# Altium schematic sheet STM32H730_PINOUT.SchDoc
size D; SheetNumber: 17; SheetTotal: 19
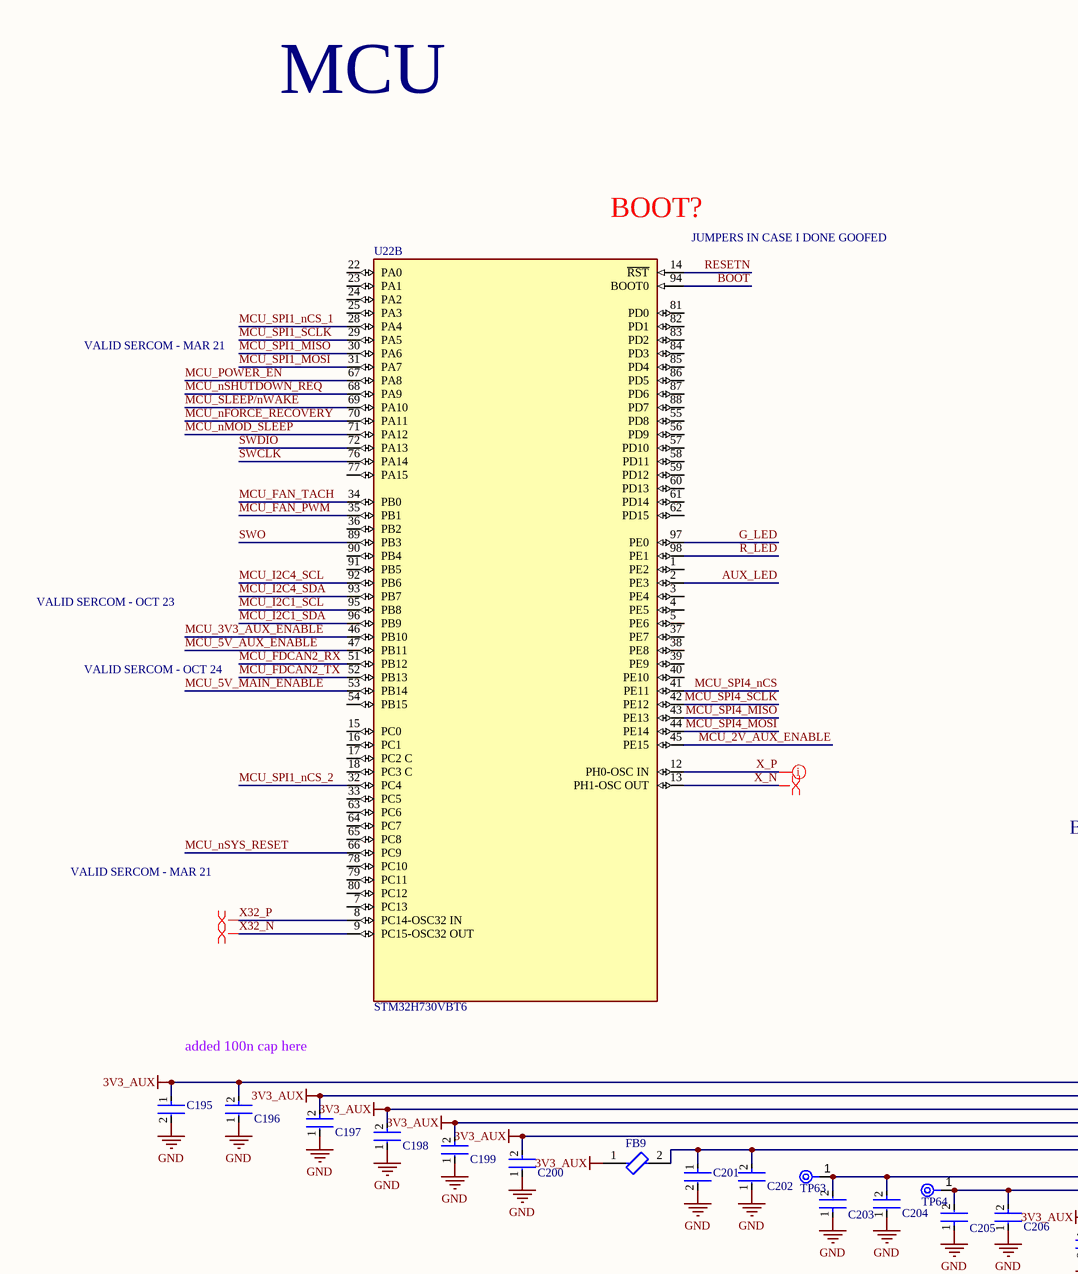
[diagram p0: STM32H730_PINOUT.SchDoc, top left]
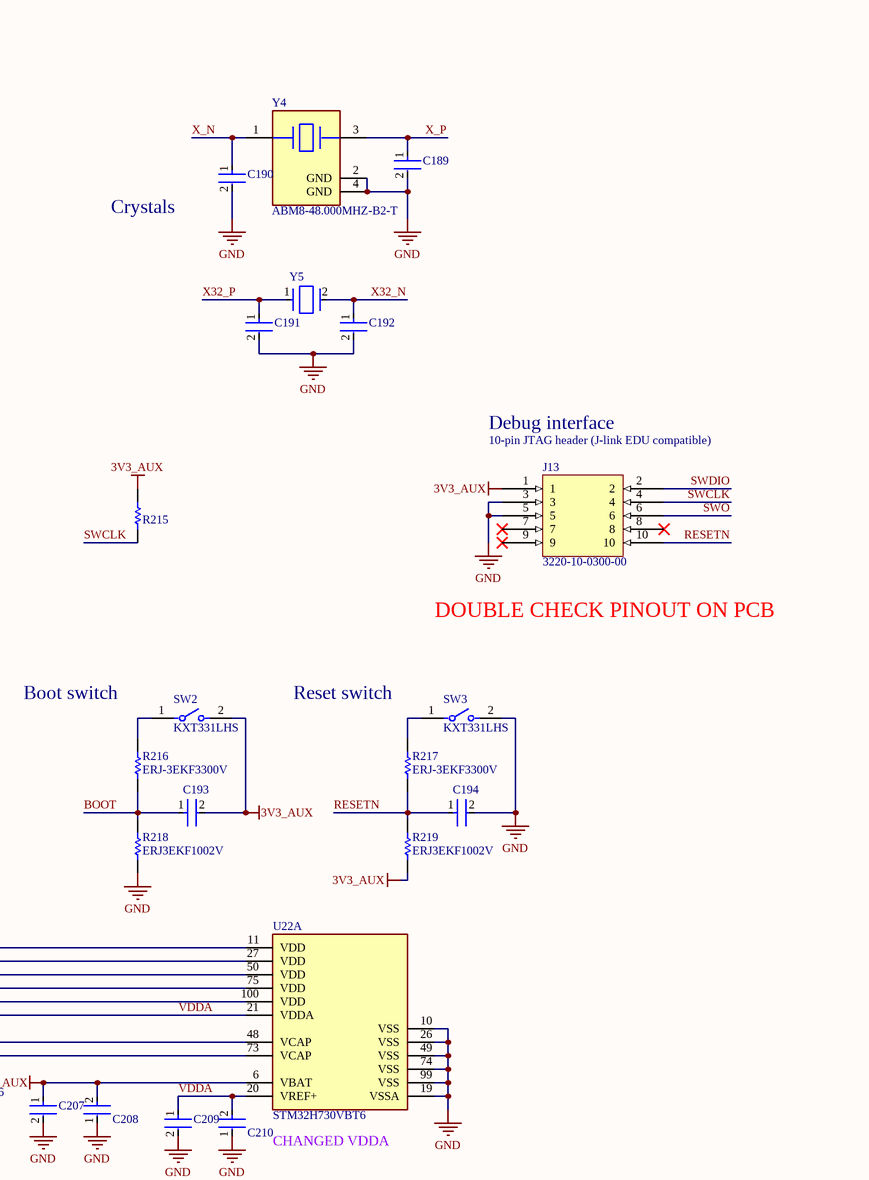
[diagram p1: STM32H730_PINOUT.SchDoc, top middle]
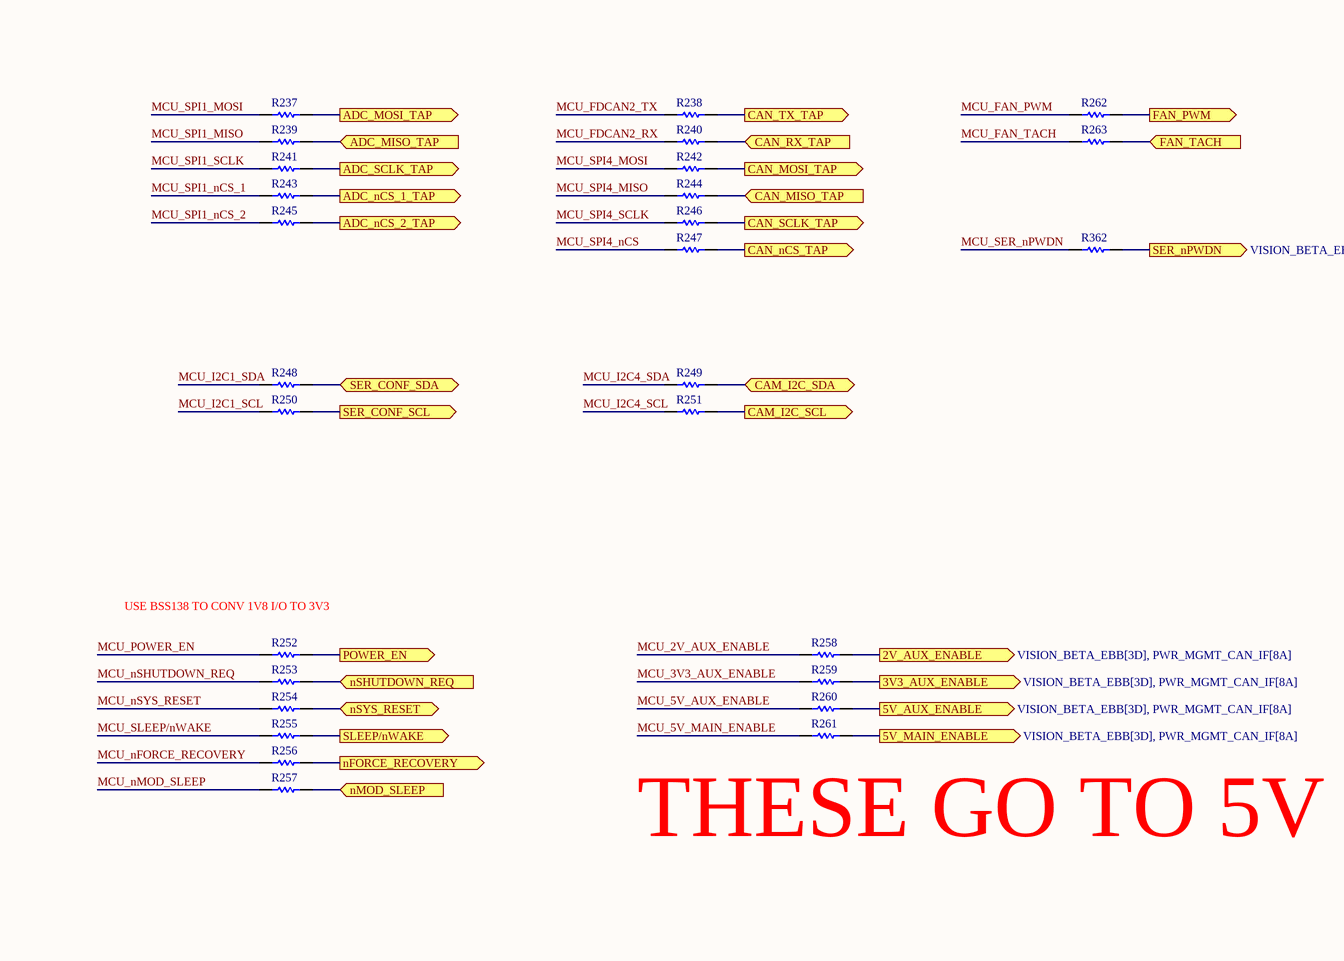
[diagram p2: STM32H730_PINOUT.SchDoc, top right]
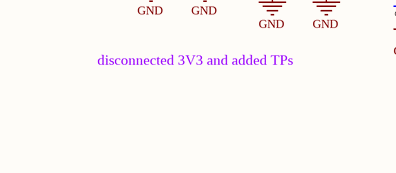
[diagram p3: STM32H730_PINOUT.SchDoc, bottom left]
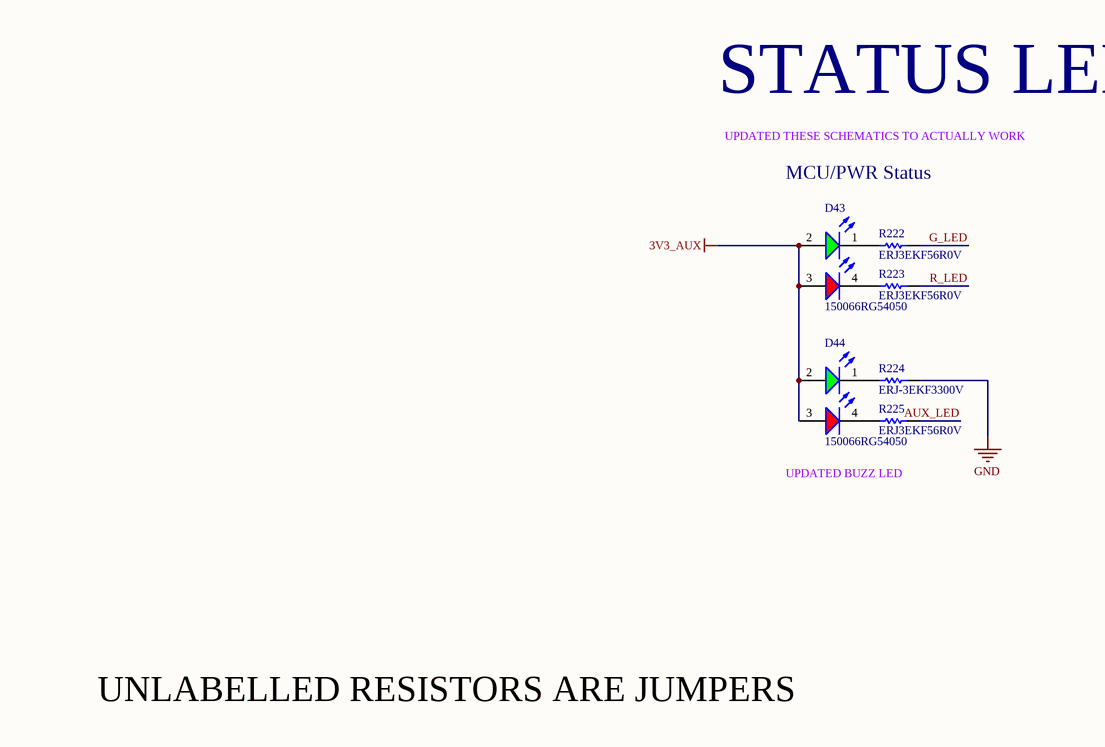
[diagram p4: STM32H730_PINOUT.SchDoc, bottom right]

## Parts
C189  C0402C689C5GACTU  [FP-C0402-BB-MFG]  (value not drawn)
C190  C0402C689C5GACTU  [FP-C0402-BB-MFG]  (value not drawn)
C191  04025A180FAT2A  [FP-0402-L_1_0_1-W_0_5_0_1-IPC_A]  (value not drawn)
C192  04025A180FAT2A  [FP-0402-L_1_0_1-W_0_5_0_1-IPC_A]  (value not drawn)
C193  C0402C104K8PACTU  [FP-C0402-BB-MFG]  (value not drawn)
C194  C0402C104K8PACTU  [FP-C0402-BB-MFG]  (value not drawn)
C195  C1005X5R1A475K050BC  [FP-C1005-050-0_15-MFG]  (value not drawn)
C196  GRM155R71C104KA88D  [FP-GRM15-MFG]  (value not drawn)
C197  GRM155R71C104KA88D  [FP-GRM15-MFG]  (value not drawn)
C198  GRM155R71C104KA88D  [FP-GRM15-MFG]  (value not drawn)
C199  GRM155R71C104KA88D  [FP-GRM15-MFG]  (value not drawn)
C200  GRM155R71C104KA88D  [FP-GRM15-MFG]  (value not drawn)
C201  EMK105BJ105KV-F  [FP-0402-L_1_0_0_05-W_0_5-IPC_A]  (value not drawn)
C202  GRM155R71C104KA88D  [FP-GRM15-MFG]  (value not drawn)
C203  C1005X7S1A225K050BC  [FP-C1005-050-0_15-0_1-MFG]  (value not drawn)
C204  GRM155R71C104KA88D  [FP-GRM15-MFG]  (value not drawn)
C205  C1005X7S1A225K050BC  [FP-C1005-050-0_15-0_1-MFG]  (value not drawn)
C206  GRM155R71C104KA88D  [FP-GRM15-MFG]  (value not drawn)
C207  EMK105BJ105KV-F  [FP-0402-L_1_0_0_05-W_0_5-IPC_A]  (value not drawn)
C208  GRM155R71C104KA88D  [FP-GRM15-MFG]  (value not drawn)
C209  EMK105BJ105KV-F  [FP-0402-L_1_0_0_05-W_0_5-IPC_A]  (value not drawn)
C210  GRM155R71C104KA88D  [FP-GRM15-MFG]  (value not drawn)
D43  150066RG54050  [WL-SBCD_0606]
D44  150066RG54050  [WL-SBCD_0606]
FB9  BLM15PX601SN1D  [FP-BLM15-0_05-MFG]  (value not drawn)
J13  3220-10-0300-00  [3220-10-0300-00-Footprint-1]
R215  ERJ3EKF1002V  [RESC1609X55X30LL15T15]  (value not drawn)
R216  ERJ-3EKF3300V  [RESC1608X55X30LL15T15]
R217  ERJ-3EKF3300V  [RESC1608X55X30LL15T15]
R218  ERJ3EKF1002V  [RESC1609X55X30LL15T15]
R219  ERJ3EKF1002V  [RESC1609X55X30LL15T15]
R222  ERJ3EKF56R0V  [RESC1608X55X30NL15T15]
R223  ERJ3EKF56R0V  [RESC1608X55X30NL15T15]
R224  ERJ-3EKF3300V  [RESC1608X55X30LL15T15]
R225  ERJ3EKF56R0V  [RESC1608X55X30NL15T15]
R237  0402 JUMPER  [RESC1005X40X25ML05T05]  (value not drawn)
R238  0402 JUMPER  [RESC1005X40X25ML05T05]  (value not drawn)
R239  0402 JUMPER  [RESC1005X40X25ML05T05]  (value not drawn)
R240  0402 JUMPER  [RESC1005X40X25ML05T05]  (value not drawn)
R241  0402 JUMPER  [RESC1005X40X25ML05T05]  (value not drawn)
R242  0402 JUMPER  [RESC1005X40X25ML05T05]  (value not drawn)
R243  0402 JUMPER  [RESC1005X40X25ML05T05]  (value not drawn)
R244  0402 JUMPER  [RESC1005X40X25ML05T05]  (value not drawn)
R245  0402 JUMPER  [RESC1005X40X25ML05T05]  (value not drawn)
R246  0402 JUMPER  [RESC1005X40X25ML05T05]  (value not drawn)
R247  0402 JUMPER  [RESC1005X40X25ML05T05]  (value not drawn)
R248  0402 JUMPER  [RESC1005X40X25ML05T05]  (value not drawn)
R249  0402 JUMPER  [RESC1005X40X25ML05T05]  (value not drawn)
R250  0402 JUMPER  [RESC1005X40X25ML05T05]  (value not drawn)
R251  0402 JUMPER  [RESC1005X40X25ML05T05]  (value not drawn)
R252  0402 JUMPER  [RESC1005X40X25ML05T05]  (value not drawn)
R253  0402 JUMPER  [RESC1005X40X25ML05T05]  (value not drawn)
R254  0402 JUMPER  [RESC1005X40X25ML05T05]  (value not drawn)
R255  0402 JUMPER  [RESC1005X40X25ML05T05]  (value not drawn)
R256  0402 JUMPER  [RESC1005X40X25ML05T05]  (value not drawn)
R257  0402 JUMPER  [RESC1005X40X25ML05T05]  (value not drawn)
R258  0402 JUMPER  [RESC1005X40X25ML05T05]  (value not drawn)
R259  0402 JUMPER  [RESC1005X40X25ML05T05]  (value not drawn)
R260  0402 JUMPER  [RESC1005X40X25ML05T05]  (value not drawn)
R261  0402 JUMPER  [RESC1005X40X25ML05T05]  (value not drawn)
R262  0402 JUMPER  [RESC1005X40X25ML05T05]  (value not drawn)
R263  0402 JUMPER  [RESC1005X40X25ML05T05]  (value not drawn)
R362  0402 JUMPER  [RESC1005X40X25ML05T05]  (value not drawn)
SW2  KXT331LHS  [FP-KXT331LHS-MFG]
SW3  KXT331LHS  [FP-KXT331LHS-MFG]
TP63  TPAD6R  [New footprint 1]  (value not drawn)
TP64  TPAD6R  [New footprint 1]  (value not drawn)
U22  STM32H730VBT6  [FP-LQFP100-1L-IPC_C]  (parts A,B of 2)
Y4  ABM8-48.000MHZ-B2-T  [FP-ABM8-MFG]
Y5  ECS-.327-12.5-1210-TR  [FP-ECX-1210-MFG]  (value not drawn)

## Ports
2V_AUX_ENABLE (out, see VISION_BETA_EBB[3D], PWR_MGMT_CAN_IF[8A]), 3V3_AUX_ENABLE (out, see VISION_BETA_EBB[3D], PWR_MGMT_CAN_IF[8A]), 5V_AUX_ENABLE (out, see VISION_BETA_EBB[3D], PWR_MGMT_CAN_IF[8A]), 5V_MAIN_ENABLE (out, see VISION_BETA_EBB[3D], PWR_MGMT_CAN_IF[8A]), ADC_MISO_TAP (in, see VISION_BETA_EBB[3D]), ADC_MOSI_TAP (out, see VISION_BETA_EBB[3D]), ADC_nCS_1_TAP (out, see VISION_BETA_EBB[3D]), ADC_nCS_2_TAP (out, see VISION_BETA_EBB[3D]), ADC_SCLK_TAP (out, see VISION_BETA_EBB[3D]), CAM_I2C_SCL (out, see VISION_BETA_EBB[3D]), CAM_I2C_SDA (bidir, see VISION_BETA_EBB[3D]), CAN_MISO_TAP (in, see VISION_BETA_EBB[3D], PWR_MGMT_CAN_IF[1C]), CAN_MOSI_TAP (out, see VISION_BETA_EBB[3D], PWR_MGMT_CAN_IF[1C]), CAN_nCS_TAP (out, see VISION_BETA_EBB[3D], PWR_MGMT_CAN_IF[1C]), CAN_RX_TAP (in, see VISION_BETA_EBB[3D]), CAN_SCLK_TAP (out, see VISION_BETA_EBB[3D], PWR_MGMT_CAN_IF[1C]), CAN_TX_TAP (out, see VISION_BETA_EBB[3D]), FAN_PWM (out, see VISION_BETA_EBB[3D], FAN_IF[1A]), FAN_TACH (in, see VISION_BETA_EBB[3D], FAN_IF[1A]), nFORCE_RECOVERY (out, see VISION_BETA_EBB[3D], JETSON[9D], PWR_MGMT_CAN_IF[3A]), nMOD_SLEEP (in, see VISION_BETA_EBB[3D], JETSON[9D], PWR_MGMT_CAN_IF[3A]), nSHUTDOWN_REQ (in, see VISION_BETA_EBB[3D], JETSON[9C], PWR_MGMT_CAN_IF[3A]), nSYS_RESET (bidir, see VISION_BETA_EBB[3D], JETSON[9D], PWR_MGMT_CAN_IF[3A]), POWER_EN (out, see VISION_BETA_EBB[3D], JETSON[9D], PWR_MGMT_CAN_IF[3A]), SER_CONF_SCL (out, see VISION_BETA_EBB[3D]), SER_CONF_SDA (bidir, see VISION_BETA_EBB[3D]), SER_nPWDN (out, see VISION_BETA_EBB[3D]), SLEEP/nWAKE (out, see VISION_BETA_EBB[3D], JETSON[9C], PWR_MGMT_CAN_IF[3A])

## Nets
3V3_AUX: C193.2 C195.1 C196.2 C197.2 C198.2 C199.2 C200.2 C207.1 C208.2 D43.2(A) D43.3(A) D44.2(A) D44.3(A) FB9.1 J13.1 R215.1 R219.1 SW2.2 U22.6(VBAT) U22.11(VDD) U22.27(VDD) U22.50(VDD) U22.75(VDD) U22.100(VDD)
GND: C189.2 C190.2 C191.2 C192.2 C194.2 C195.2 C196.1 C197.1 C198.1 C199.1 C200.1 C201.2 C202.1 C203.1 C204.1 C205.1 C206.1 C207.2 C208.1 C209.2 C210.1 J13.3 J13.5 R218.1 R224.2 SW3.2 U22.10(VSS) U22.19(VSSA) U22.26(VSS) U22.49(VSS) U22.74(VSS) U22.99(VSS) Y4.2(GND) Y4.4(GND)
2V_AUX_ENABLE: R258.2 ; port 2V_AUX_ENABLE
3V3_AUX_ENABLE: R259.2 ; port 3V3_AUX_ENABLE
5V_AUX_ENABLE: R260.2 ; port 5V_AUX_ENABLE
5V_MAIN_ENABLE: R261.2 ; port 5V_MAIN_ENABLE
ADC_MISO_TAP: R239.2 ; port ADC_MISO_TAP
ADC_MOSI_TAP: R237.2 ; port ADC_MOSI_TAP
ADC_nCS_1_TAP: R243.2 ; port ADC_nCS_1_TAP
ADC_nCS_2_TAP: R245.2 ; port ADC_nCS_2_TAP
ADC_SCLK_TAP: R241.2 ; port ADC_SCLK_TAP
AUX_LED: R225.1 U22.2(PE3)
BOOT: C193.1 R216.1 R218.2 U22.94(BOOT0)
CAM_I2C_SCL: R251.2 ; port CAM_I2C_SCL
CAM_I2C_SDA: R249.2 ; port CAM_I2C_SDA
CAN_MISO_TAP: R244.2 ; port CAN_MISO_TAP
CAN_MOSI_TAP: R242.2 ; port CAN_MOSI_TAP
CAN_nCS_TAP: R247.2 ; port CAN_nCS_TAP
CAN_RX_TAP: R240.2 ; port CAN_RX_TAP
CAN_SCLK_TAP: R246.2 ; port CAN_SCLK_TAP
CAN_TX_TAP: R238.2 ; port CAN_TX_TAP
FAN_PWM: R262.2 ; port FAN_PWM
FAN_TACH: R263.2 ; port FAN_TACH
G_LED: R222.1 U22.97(PE0)
MCU_2V_AUX_ENABLE: R258.1 U22.45(PE15)
MCU_3V3_AUX_ENABLE: R259.1 U22.46(PB10)
MCU_5V_AUX_ENABLE: R260.1 U22.47(PB11)
MCU_5V_MAIN_ENABLE: R261.1 U22.53(PB14)
MCU_FAN_PWM: R262.1 U22.35(PB1)
MCU_FAN_TACH: R263.1 U22.34(PB0)
MCU_FDCAN2_RX: R240.1 U22.51(PB12)
MCU_FDCAN2_TX: R238.1 U22.52(PB13)
MCU_I2C1_SCL: R250.1 U22.95(PB8)
MCU_I2C1_SDA: R248.1 U22.96(PB9)
MCU_I2C4_SCL: R251.1 U22.92(PB6)
MCU_I2C4_SDA: R249.1 U22.93(PB7)
MCU_nFORCE_RECOVERY: R256.1 U22.70(PA11)
MCU_nMOD_SLEEP: R257.1 U22.71(PA12)
MCU_nSHUTDOWN_REQ: R253.1 U22.68(PA9)
MCU_nSYS_RESET: R254.1 U22.66(PC9)
MCU_POWER_EN: R252.1 U22.67(PA8)
MCU_SER_nPWDN: R362.1
MCU_SLEEP/nWAKE: R255.1 U22.69(PA10)
MCU_SPI1_MISO: R239.1 U22.30(PA6)
MCU_SPI1_MOSI: R237.1 U22.31(PA7)
MCU_SPI1_nCS_1: R243.1 U22.28(PA4)
MCU_SPI1_nCS_2: R245.1 U22.32(PC4)
MCU_SPI1_SCLK: R241.1 U22.29(PA5)
MCU_SPI4_MISO: R244.1 U22.43(PE13)
MCU_SPI4_MOSI: R242.1 U22.44(PE14)
MCU_SPI4_nCS: R247.1 U22.41(PE11)
MCU_SPI4_SCLK: R246.1 U22.42(PE12)
nFORCE_RECOVERY: R256.2 ; port nFORCE_RECOVERY
nMOD_SLEEP: R257.2 ; port nMOD_SLEEP
nSHUTDOWN_REQ: R253.2 ; port nSHUTDOWN_REQ
nSYS_RESET: R254.2 ; port nSYS_RESET
POWER_EN: R252.2 ; port POWER_EN
R_LED: R223.1 U22.98(PE1)
RESETN: C194.1 J13.10 R217.1 R219.2 U22.14(~{RST})
SER_CONF_SCL: R250.2 ; port SER_CONF_SCL
SER_CONF_SDA: R248.2 ; port SER_CONF_SDA
SER_nPWDN: R362.2 ; port SER_nPWDN
SLEEP/nWAKE: R255.2 ; port SLEEP/nWAKE
SWCLK: J13.4 R215.2 U22.76(PA14)
SWDIO: J13.2 U22.72(PA13)
SWO: J13.6 U22.89(PB3)
VDDA: C201.1 C202.2 C209.1 C210.2 FB9.2 U22.20(VREF+) U22.21(VDDA)
X32_N: C192.1 U22.9(PC15-OSC32_OUT) Y5.2(Out/In)
X32_P: C191.1 U22.8(PC14-OSC32_IN) Y5.1(In/Out)
X_N: C190.1 U22.13(PH1-OSC_OUT) Y4.1
X_P: C189.1 U22.12(PH0-OSC_IN) Y4.3
NetC203_2: C203.2 C204.2 TP63.1(TP) U22.48(VCAP)
NetC205_2: C205.2 C206.2 TP64.1(TP) U22.73(VCAP)
NetD43_1: D43.1(K) R222.2
NetD43_4: D43.4(K) R223.2
NetD44_1: D44.1(K) R224.1
NetD44_4: D44.4(K) R225.2
NetR216_2: R216.2 SW2.1
NetR217_2: R217.2 SW3.1

Not connected (* = marked no-connect by the designer): J13 7* 8* 9*; U22 1(PE2) 3(PE4) 4(PE5) 5(PE6) 7(PC13) 15(PC0) 16(PC1) 17(PC2_C) 18(PC3_C) 22(PA0) 23(PA1) 24(PA2) 25(PA3) 33(PC5) 36(PB2) 37(PE7) 38(PE8) 39(PE9) 40(PE10) 54(PB15) 55(PD8) 56(PD9) 57(PD10) 58(PD11) 59(PD12) 60(PD13) 61(PD14) 62(PD15) 63(PC6) 64(PC7) 65(PC8) 77(PA15) 78(PC10) 79(PC11) 80(PC12) 81(PD0) 82(PD1) 83(PD2) 84(PD3) 85(PD4) 86(PD5) 87(PD6) 88(PD7) 90(PB4) 91(PB5)

## Layout directives
differential pair: X32_N, X32_P, X_N, X_P

## Notes on the sheet
- MCU
- (near U22) BOOT?
- (near U22) JUMPERS IN CASE I DONE GOOFED
- VALID SERCOM - MAR 21
- (near C190) Crystals
- Debug interface
- VALID SERCOM - OCT 23
- (near J13) 10-pin JTAG header (J-link EDU compatible)
- (near R252) USE BSS138 TO CONV 1V8 I/O TO 3V3
- VALID SERCOM - OCT 24
- DOUBLE CHECK PINOUT ON PCB
- Boot switch
- Reset switch
- (near R261) THESE GO TO 5V
- added 100n cap here
- disconnected 3V3 and added TPs
- CHANGED VDDA
- STATUS LEDs
- UPDATED THESE SCHEMATICS TO ACTUALLY WORK
- MCU/PWR Status
- UPDATED BUZZ LED
- UNLABELLED RESISTORS ARE JUMPERS

## Library data of the parts
C189 C190 = CMP-1034-00517-3: CAP CER 6.8PF 50V NP0 0402; Manufacturer: Kemet; Material: Ceramic; Temperature Characteristic: C0G; Tolerance: 0.25 pF; Temperature Coefficient: 15%; ComponentLink2URL: https://content.kemet.com/datasheets/KEM_C1002_X7R_SMD.pdf; Octopart: https://octopart.com/c0402c689c5gactu-kemet-9143567; RoHS: TRUE; Temperature: -55°C to +125°C; Device Class L2: Capacitors; ComponentLink2Description: Datasheet; Mouser Description: Cap Ceramic 6.8pF 50V C0G 0.25pF SMD 0402 125°C Paper T/R; Device Class L3: Ceramic Capacitors; Digikey Description: CAP CER 6.8PF 50V NP0 0402; Temperature Range High: +125°C; Package: C0402-BB; Voltage Rating: 50 V; Height: 0.55mm; Ipc Land Pattern Name: CAPC10050X50; Value: 6.8 pF; Device Class L1: Passive Components; Category: Cap; Manufacturer Part Number: C0402C689C5GACTU; Capacitance: 6.8 pF; Lead Free: Yes; Automotive: No; Temperature Range Low: -55°C
C191 C192 = CMP-2008-02590-2: General Purpose Ceramic Capacitor, 0402, 18pF, 1%, C0G, 30ppm/°C, 50V; Depth: 0.5mm; Packaging: Tape and Reel; Number of Pins: 2; Tolerance: 1%; Min Operating Temperature: -55°C; Capacitance: 18pF; Termination: SMD/SMT; Lead Free: Lead Free; Case Code (Metric): 1005; Radiation Hardening: No; Package Quantity: 1; Max Operating Temperature: 125°C; Voltage Rating: 50V; Construction: Flat; Dielectric: C0G; Length: 1mm; REACH SVHC: No SVHC; Case Code (Imperial): 0402; Series: -; RoHS Compliant: Yes; Voltage Rating (DC): 50V; Mount: Surface Mount; Case/Package: 0402; Width: 0.5mm; Thickness: 0.022inch; Contact Plating: Tin
C193 C194 = CMP-2008-02046-2: CAP CER 0.1UF 10V X5R 0402; Manufacturer: Kemet; Material: Ceramic; Capacitance: 0.10 μF; Temperature Coefficient: 15%; Tolerance: 0.1; Value: 0.10 μF; Package: C0402-BB; Temperature: -55°C to +125°C; ComponentLink2Description: Datasheet; Temperature Characteristic: X5R; Device Class L1: Passive Components; Height: 0.55mm; Lead Free: Yes; ComponentLink2URL: https://content.kemet.com/datasheets/KEM_C1002_X7R_SMD.pdf; Device Class L2: Capacitors; Temperature Range Low: -55°C; Temperature Range High: +125°C; RoHS: TRUE; Octopart: https://octopart.com/c0402c104k8pactu-kemet-140039; Automotive: No; Mouser Description: Capacitor 100 nF 10 VDC 0402; Category: Cap; Voltage Rating: 10 V; Digikey Description: CAP CER 0.1UF 10V X5R 0402; Ipc Land Pattern Name: CAPC10050X50; Device Class L3: Ceramic Capacitors; Manufacturer Part Number: C0402C104K8PACTU
C195 = CMP-2000-05997-2: CAP CER 4.7UF 10V X5R 0402; Dielectric Material: Ceramic; Tolerance: 10%; Series: C; Package Quantity: 10000; Max Operating Temperature: 85°C; Case Code (Imperial): 0402; Lead Free: Lead Free; Voltage Rating (DC): 10V; Packaging: Cut Tape; Voltage Rating: 10V; Min Operating Temperature: -55°C; Dielectric: X5R; Thickness: 0.022inch; Width: 0.02inch; Case/Package: 0402; Case Code (Metric): 1005; Capacitance: 4.7uF; Length: 0.039inch; RoHS Compliant: Yes; REACH SVHC: No SVHC; Mount: Surface Mount
C196-C200 C202 C204 C206 C208 C210 = CMP-2100-03641-2: CAP CER 0.1UF 16V X7R 0402; Manufacturer: Murata; Standoff Height: 0mm; Tolerance: 10%; Voltage Rating: 16Vdc; Material: Ceramic; Capacitance: 0.10μF; Value: 0.10μF; RoHS: TRUE; Manufacturer Part Number: GRM155R71C104KA88D; Temperature Characteristic: X7R; Octopart: https://octopart.com/grm155r71c104ka88d-murata-196880; Digikey Description: CAP CER 0.1UF 16V X7R 0402; Device Class L3: Ceramic Capacitors; Height: 0.55mm; ComponentLink2Description: Datasheet; Temperature Range Low: -55°C; Ipc Land Pattern Name: CAPC10050X219; ComponentLink2URL: https://search.murata.co.jp/Ceramy/image/img/A01X/G101/ENG/GRM155R71H471KA01-01A.pdf; Device Class L1: Passive Components; Lead Free: yes; Category: Cap; Package: GRM15; Temperature: -55°C to +125°C; Device Class L2: Capacitors; Temperature Range High: +125°C; Mouser Description: 0402 0.1 uF 16V ±10 % Tolerance X7R SMT Multilayer Ceramic Capacitor
C201 C207 C209 = CMP-14477-000104-2: None; Tolerance: 10%; Voltage Rating: 16V; Dielectric: X5R; Capacitance: 1uF; Packaging: Tape and Reel; Depth: 0.5mm; Mount: Surface Mount; Thickness: 0.022inch; Package Quantity: 1; Min Operating Temperature: -55°C; Series: M; Voltage Rating (DC): 16V; Termination: SMD/SMT; Case/Package: 0402; Number of Pins: 2; Case Code (Imperial): 0402; Length: 1mm; Halogen Free: Halogen Free; Case Code (Metric): 1005; Width: 0.02inch; RoHS Compliant: Yes; Radiation Hardening: No; Max Operating Temperature: 85°C; Height: 0.5mm; Construction: Flat
C203 C205 = CMP-08246-004344-1: CAP CER 2.2UF 10V X7S 0402; Dielectric Material: Ceramic; Tolerance: 10%; Mount: Surface Mount; Height: 0.5mm; Package Quantity: 1; Depth: 0.5mm; RoHS Compliant: Yes; Length: 1mm; Thickness: 0.022inch; Packaging: Tape and Reel; Capacitance: 2.2uF; Case Code (Imperial): 0402; Resistor Type: Ceramic; Dielectric: X7S; Case/Package: 0402; Min Operating Temperature: -55°C; Voltage Rating: 10V; Series: C; Weight: 2.3E-05oz; Width: 0.02inch; Voltage Rating (DC): 10V; Case Code (Metric): 1005; Max Operating Temperature: 125°C; Termination: SMD/SMT; Lead Free: Lead Free
D43 D44 = CMP-004-00040-2: Led, Red/Grn, 180Mcd/230Mcd, 624Nm/525Nm Rohs Compliant: Yes; Source: rgled.SchLib; Component Type: Standard; Design Item ID: CMP-004-00034-2; Pins: 4
FB9 = CMP-0686-00252-4: Chip Ferrite Bead, 0402, 600Ω @ 100MHz, 0.23Ω, 25%, 900mA; Number of Circuits: 1; Impedance: 600R; DC Resistance (DCR): 230mR; Material: Steel; Length: 1mm; Package Quantity: 10000; Height: 0.5mm; Width: 0.5mm; Max DC Current: 900mA; Number of Lines: 1; Termination: SMD/SMT; Packaging: Tape and Reel; Lead Free: Lead Free; Min Operating Temperature: -55°C; Max Operating Temperature: 125°C; Max Current Rating: 900mA; Case Code (Imperial): 0402; Number of Pins: 2; Current Rating: 900mA; Test Frequency: 100MHz; Case/Package: 0402; Tolerance: 25%; Case Code (Metric): 1005
J13 = CMP-001-0013-3: CONN HEADER SMD 10POS 1.27MM
R215 R218 R219 = CMP-1012-00623-3: Chip Resistor, 10 KOhm, +/- 1%, 0.1 W, -55 to 155 degC, 0603 (1608 Metric), RoHS, Tape and Reel; Manufacturer: Panasonic; Voltage Rating: 75V; Case\/Package: 0603; Power Rating: 100mW; Resistance: 10KOhm; Temperature Coefficient: 100ppm\/degreesC; Number of Pins: 2; Package Reference: 603; Depth: 0.8mm; Mount: SurfaceMount; Package Description: 2-Pin Surface Mount Device, Body 1.6 x 0.85 mm; Datasheet Version: 02/2017; Length: 1.6mm; Lead Free: LeadFree; Height: 0.45mm; Number of Terminations: 2; Max Power Dissipation: 100mW; Min Operating Temperature: -55degC; Datasheet URL: https://industrial.panasonic.com/cdbs/www-data/pdf/RDA0000/AOA0000C304.pdf; Termination: SMD/SMT; Case Code (Metric): 1608; Case Code (Imperial): 0603; Tolerance: 1%; Max Operating Temperature: 155degC; RoHSCompliant: true; Voltage Rating (DC): 75V; Radiation Hardening: No; Packaging: TapeandReel; Composition: ThickFilm; Mounting Technology: SurfaceMount; Manufacturer URL: http://www.panasonic.com/; Width: 0.031inch; REACH SVHC: NoSVHC; Contact Plating: Tin; Military Standard: Not; Package Quantity: 1
R216 R217 R224 = CMP-2000-00435-2: Chip Resistor, 330 Ohm, +/- 1%, 0.1 W, -55 to 155 degC, 0603 (1608 Metric), RoHS, Tape and Reel; Gender: Male; Mating Cycles: 10000; Current Rating: 500 mA; Voltage Rating: 10 V; REACH SVHC: No SVHC; PackageDescription: 2-Pin Surface Mount Device, Body 1.6 x 0.85 mm; Contact Finish: Gold; Pins: 8; ComponentLink1Description: Manufacturer URL; Packaging: Tape and Reel; Max Operating Temperature: 85 degC; Contact Material: Copper; Height: 1.45 mm; Width: 1.45 mm; DatasheetVersion: Apr-15; Package Quantity: 1500; Contact Plating: Gold; PackageReference: 0603; Mount: Surface Mount; Lead Pitch: 1.1 mm; Min Operating Temperature: -25 degC; ComponentLink1URL: http://www.panasonic.com/; ComponentLink2URL: http://industrial.panasonic.com/cdbs/www-data/pdf/RDA0000/AOA0000C86.pdf; Length: 13.7 mm; ComponentLink2Description: Datasheet; RoHSCompliant: true
R222 R223 R225 = CMP-2000-00572-1: Manufacturer: Panasonic; Part Number: ERJ3EKF56R0V
R237-R263 R362 = CMP-009-00118-2: READ THE NAME; Pins: 2; Component Type: Standard; Design Item ID: CMP-009-00206-2; Source: 0402jump.SchLib
SW2 SW3 = CMP-10040-000029-1: SWITCH TACTILE SPST-NO 0.02A 15V; Operating Force: 240gf; Switch Travel: 0.13mm; Illumination Type: Non-Illuminated; Throw Configuration: SPST; Number of Ports: 1; Current Rating: 5A; Mechanical Life: 500000Cycles; Switch Function: Off-Mom; Connector Type: USB; Actuator Type: Standard; Gender: Receptacle; Number of Contacts: 24; Contact Plating: Gold; Insulation Color: Black; Min Operating Temperature: -40°C; Packaging: Tape and Reel; Flammability Rating: UL94 V-0; Max Operating Temperature: 85°C; Termination: Solder; Mount: Surface Mount
TP63 TP64 = CMP-00025-2: Test Point .6mm
U22 = CMP-12105-000107-1: IC MCU 32BIT 128KB FLASH 100LQFP
Y4 = CMP-27762-011708-1: Crystal 48MHz ±20ppm 18pF SMD-4 3.2mm x 2.5mm; Series Resistance: 35R; Frequency Stability: 50ppm; Package Quantity: 1000; Packaging: Tape and Reel; Mount: Surface Mount; Length: 3.2mm; Load Capacitance: 18pF; Max Operating Temperature: 70°C; Operating Frequency: 48 MHz; RoHS Compliant: Yes; Series: ABM8; Frequency Tolerance: 20ppm; Lead Free: Lead Free; Min Operating Temperature: -20°C; Case/Package: CSMD; Number of Pins: 4; Height: 0.031inch; ESR (Equivalent Series Resistance): 35R; Frequency: 48MHz; Radiation Hardening: No; Width: 0.098inch; Tolerance: 20ppm; Termination: SMD/SMT; Depth: 2.5mm; Resistor Type: Ceramic; REACH SVHC: No SVHC
Y5 = CMP-40224-000006-1: CRYSTAL 32.7680KHZ 12.5PF SMD; Manufacturer: ECS International; Frequency: 32.768kHz; Esr: 90kΩ; Tolerance: 20ppm; Device Class L1: Passive Components; Load Capacitance: 12.5pF; Temperature: -40°C to +85°C; ComponentLink2URL: https://ecsxtal.com/store/pdf/ECX-1210.pdf; Series: ECX-1210; Octopart: https://octopart.com/ecs-.327-12.5-1210-tr-ecs+international-81221340; ComponentLink2Description: Datasheet; Temperature Range Low: -40°C; Digikey Description: CRYSTAL 32.7680KHZ 12.5PF SMD; Lead Free: Yes; RoHS: TRUE; Device Class L3: Crystals; Automotive: No; Category: Crys; Height: 0.5mm; Manufacturer Part Number: ECS-.327-12.5-1210-TR; Temperature Range High: +85°C; Device Class L2: Crystals / Oscillators; Package: ECX-1210